# Altium schematic sheet Alimentation.SchDoc
size Tabloid; SheetNumber: 3; SheetTotal: 7
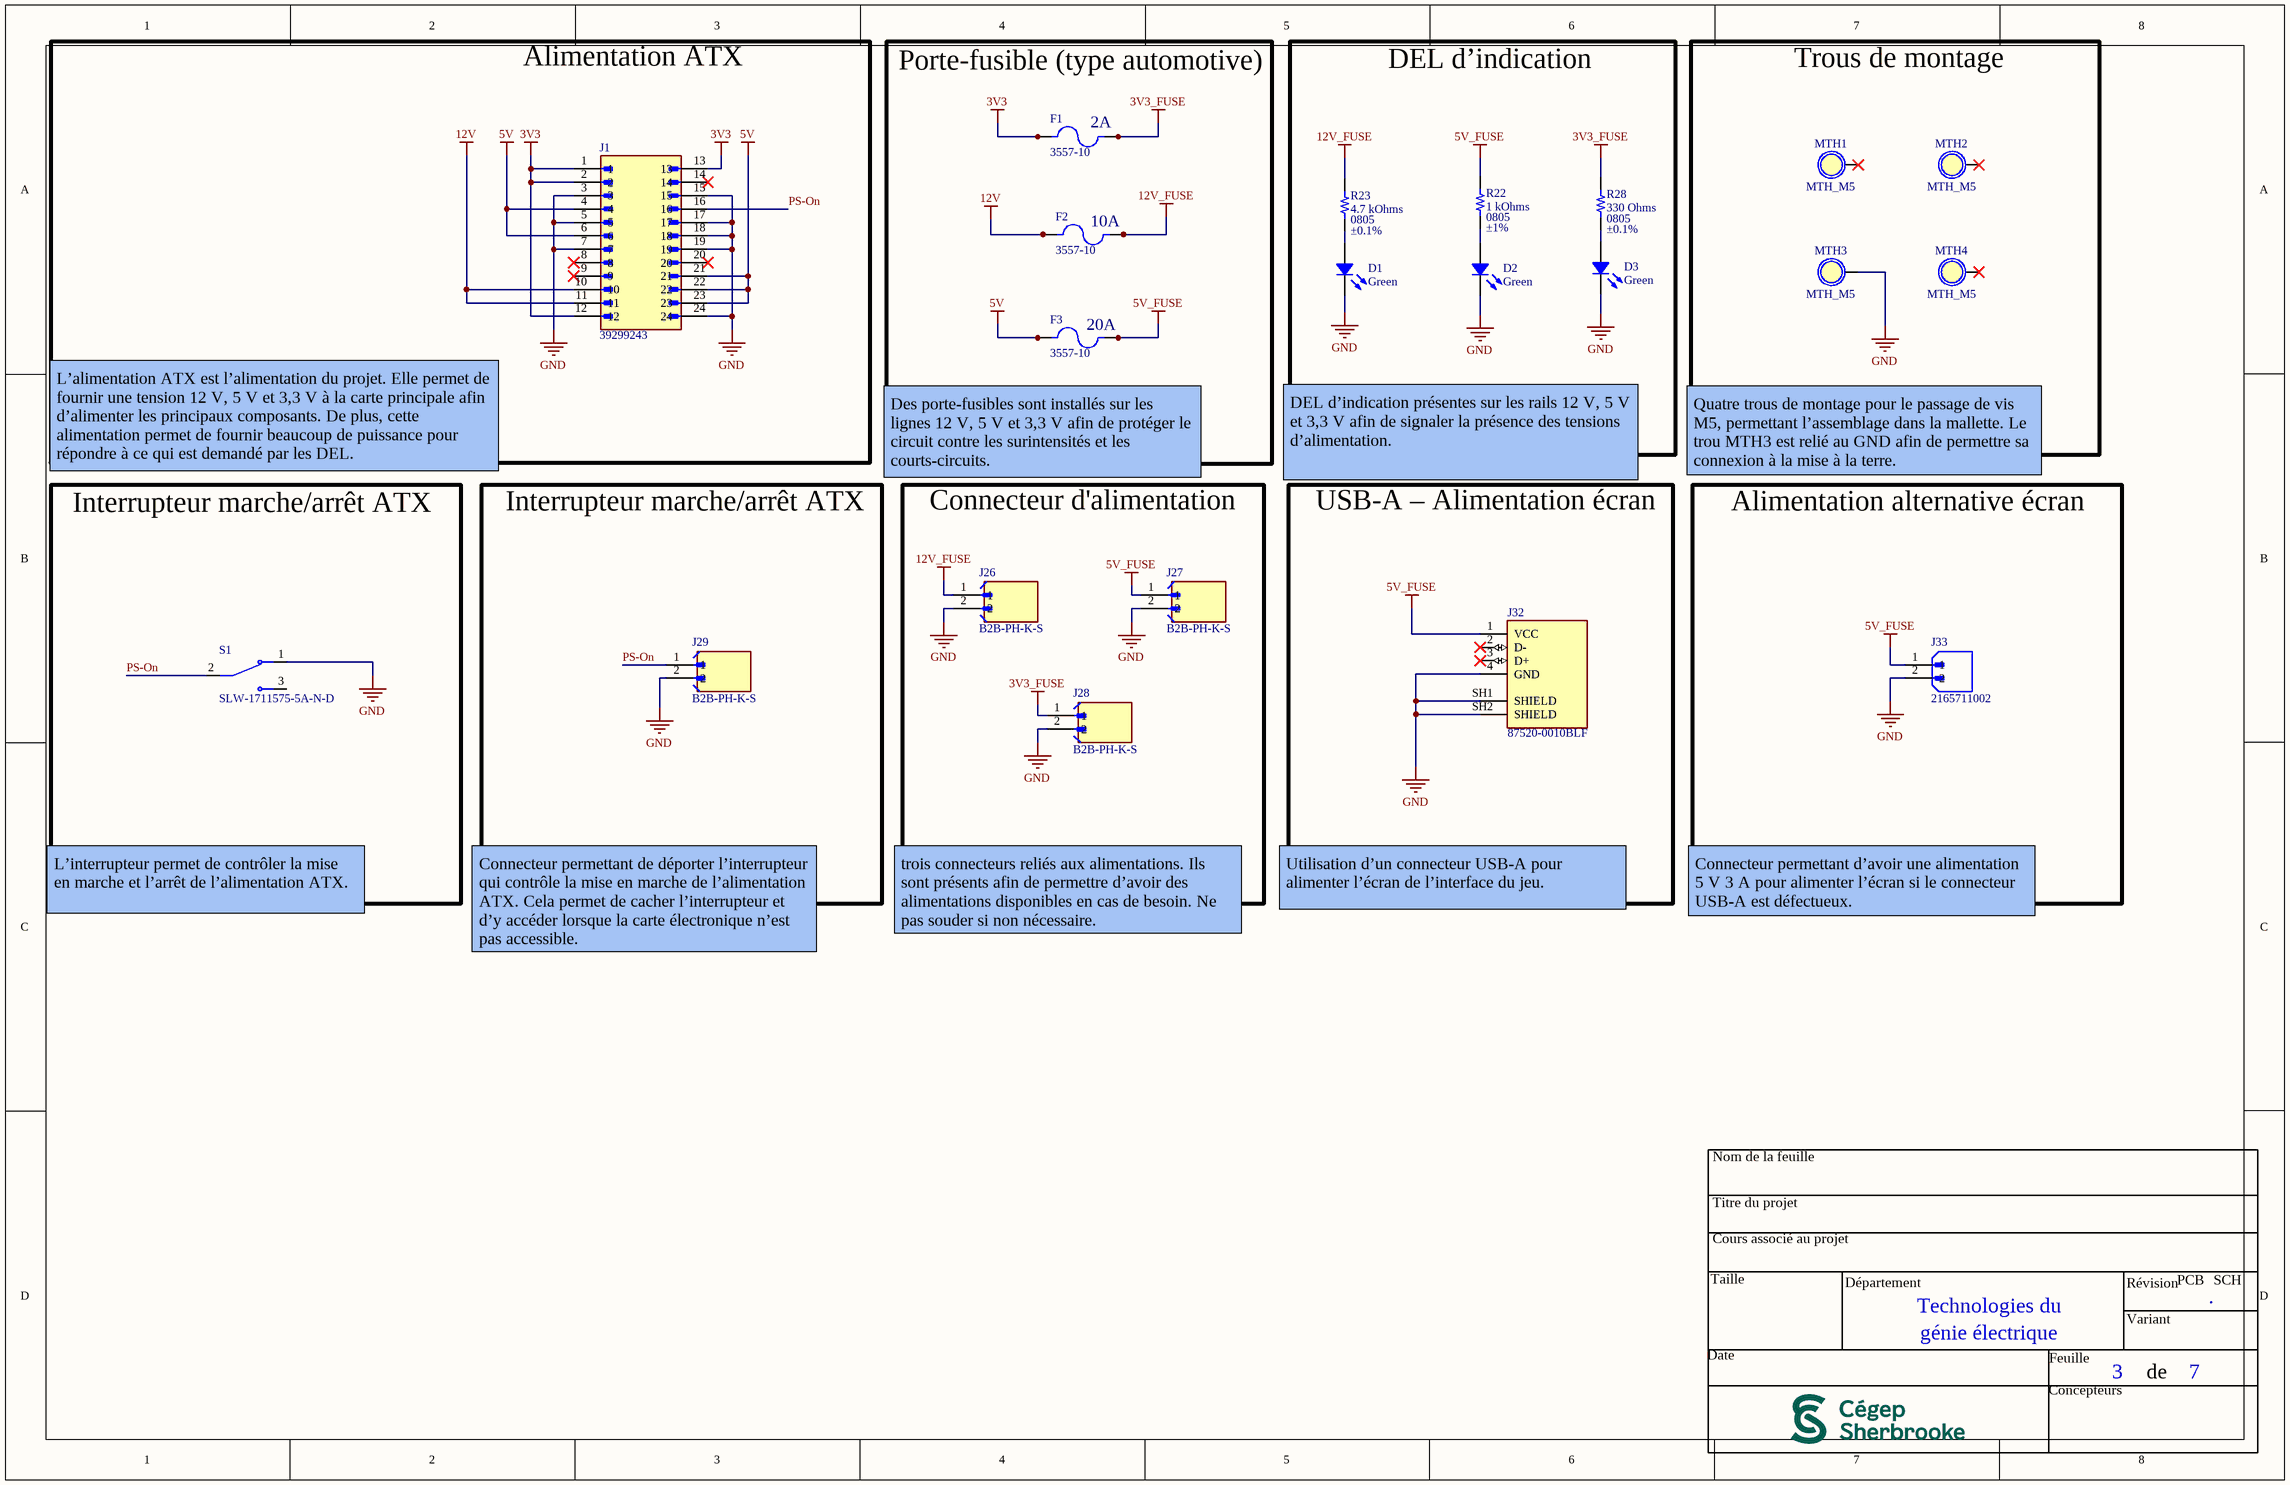
[diagram p0: Alimentation.SchDoc]

## Parts
D1  Green  [LED 0805_2012 GREEN]
D2  Green  [LED 0805_2012 GREEN]
D3  Green  [LED 0805_2012 GREEN]
F1  3557-10  [FUSE_3557-10]
F2  3557-10  [FUSE_3557-10]
F3  3557-10  [FUSE_3557-10]
J1  39299243  [MOLEX_39299243]
J26  B2B-PH-K-S  [JST_B2B-PH-K-S]
J27  B2B-PH-K-S  [JST_B2B-PH-K-S]
J28  B2B-PH-K-S  [JST_B2B-PH-K-S]
J29  B2B-PH-K-S  [JST_B2B-PH-K-S]
J32  87520-0010BLF  [AMPHENOL_87520-0010BLF]
J33  2165711002  [MOLEX_2165711002]
MTH1  MTH_M5  [MTH_M5]  (no BOM)
MTH2  MTH_M5  [MTH_M5]  (no BOM)
MTH3  MTH_M5  [MTH_M5]  (no BOM)
MTH4  MTH_M5  [MTH_M5]  (no BOM)
R22  Supplier Device Package: 0805  Tolerance: ±1%  [RES 0805_2012]  (hidden comment: 1 kOhms)
R23  Supplier Device Package: 0805  Tolerance: ±0.1%  [RES 0805_2012]  (hidden comment: 4.7 kOhms)
R28  Supplier Device Package: 0805  Tolerance: ±0.1%  [RES 0805_2012]  (hidden comment: 330 Ohms)
S1  SLW-1711575-5A-N-D  [SW_SLW-1711575-5A-N-D]

## Blocks framed on the sheet
Alimentation ATX: J1
Porte-fusible (type automotive): F1-F3
DEL d’indication: D1-D3 R22 R23 R28
Trous de montage: MTH1-MTH4
Interrupteur marche/arrêt ATX: S1
Interrupteur marche/arrêt ATX: J29
Connecteur d'alimentation: J26-J28
USB-A – Alimentation écran: J32
Alimentation alternative écran: J33

## Nets
3V3: F1.1_1 F1.1_2 J1.1 J1.2 J1.12 J1.13
3V3_FUSE: F1.2_1 F1.2_2 J28.1 R28.2
5V: F3.1_1 F3.1_2 J1.4 J1.6 J1.21 J1.22 J1.23
5V_FUSE: F3.2_1 F3.2_2 J27.1 J32.1(VCC) J33.1 R22.2
12V: F2.1_1 F2.1_2 J1.10 J1.11
12V_FUSE: F2.2_1 F2.2_2 J26.1 R23.2
GND: D1.2 D2.2 D3.2 J1.3 J1.5 J1.7 J1.15 J1.17 J1.18 J1.19 J1.24 J26.2 J27.2 J28.2 J29.2 J32.4(GND) J32.SH1(SHIELD) J32.SH2(SHIELD) J33.2 MTH3.1 S1.1
PS-On: J1.16 J29.1 S1.2
NetD1_1: D1.1 R23.1
NetD2_1: D2.1 R22.1
NetD3_1: D3.1 R28.1

Not connected (* = marked no-connect by the designer): J1 8* 9* 14* 20*; J32 2(D-)* 3(D+)*; MTH1 1*; MTH2 1*; MTH4 1*; S1 3

## Notes on the sheet
- (near F1) 2A
- (near F2) 10A
- (near F3) 20A
- L’alimentation ATX est l’alimentation du projet. Elle permet de fournir une tension 12 V, 5 V et 3,3 V à la carte principale afin d’alimenter les principaux composants. De plus, cette alimentation permet de fournir beaucoup de puissance pour répondre à ce qui est demandé par les DEL.
- (near F3) Des porte-fusibles sont installés sur les lignes 12 V, 5 V et 3,3 V afin de protéger le circuit contre les surintensités et les courts-circuits.
- DEL d’indication présentes sur les rails 12 V, 5 V et 3,3 V afin de signaler la présence des tensions d’alimentation.
- Quatre trous de montage pour le passage de vis M5, permettant l’assemblage dans la mallette. Le trou MTH3 est relié au GND afin de permettre sa connexion à la mise à la terre.
- Utilisation d’un connecteur USB-A pour alimenter l’écran de l’interface du jeu.
- L’interrupteur permet de contrôler la mise en marche et l’arrêt de l’alimentation ATX.
- Connecteur permettant de déporter l’interrupteur qui contrôle la mise en marche de l’alimentation ATX. Cela permet de cacher l’interrupteur et d’y accéder lorsque la carte électronique n’est pas accessible.
- trois connecteurs reliés aux alimentations. Ils sont présents afin de permettre d’avoir des alimentations disponibles en cas de besoin. Ne pas souder si non nécessaire.
- Connecteur permettant d’avoir une alimentation 5 V 3 A pour alimenter l’écran si le connecteur USB-A est défectueux.
- Nom de la feuille
- Titre du projet
- Cours associé au projet
- Taille
- Département
- Technologies du
- Révision
- PCB
- .
- SCH
- Date
- génie électrique
- Feuille
- Variant
- de
- Concepteurs

## Library data of the parts
D1-D3 = 5975316507F: LED GREEN 0805 SMD; Manufacturer: Dialight; Configuration: Standard; Current - Test: 20mA; Lens Color: 0.93mm; Lens Size: 1.40mm x 1.24mm; Lens Style: Rectangle with Flat Top; Millicandela Rating: 16mcd; Voltage - Forward (Vf) (Typ): 2.2V; Wavelength - Dominant: 560nm; Part Number: 5975316507F; Color: Green; ComponentLink1Description: Datasheet; ComponentLink1URL: http://www.dialightsignalsandcomponents.com/Assets/Drawings/2D_Drawings_DrawingDetailedSpec/NewDrawings/18370A.pdf; ComponentLink2Description: DigiKey Link; ComponentLink2URL: https://www.digikey.com/en/products/detail/dialight/5975316507F/9385444; Device Package: 0805 (2012 Metric); Height (Max): 0.93mm; LastUpdated: 2024-06-03 8:00:30 PM; Lifecycle Status: Active; Minimum Order: 1; Mounting Type: Surface Mount; Package / Case: 0805 (2012 Metric); Packaging: TapeAndReel; PartId: 245; Part Status: Active; Price: 0.12; Series: 597; Size / Dimension: 2.00mm L x 1.25mm W; Supplier 1: DigiKey; Supplier Part Number 1: 350-4389-1-ND; Supplier Device Package: 0805; Value: Green
F1-F3 = 3557-10: MF: Keystone; Package: None; Price: None; Value: *; MP: 3557-10; Availability: Unavailable
J1 = 39299243: Conn Wire to Board HDR 24Power POS 4.2mm Solder ST Top Entry Thru-Hole Tray; Value: *; Price: None; Package: None; Availability: Unavailable; MP: 39299243
J26-J29 = B2B-PH-K-S: Connector Header Through Hole 2 position 0.079 (2.00mm); MF: JST Sales America Inc.; SnapEDA_Link: https://www.snapeda.com/parts/B2B-PH-K-S/JST/view-part/?ref=snap; Package: None; Value: *; MP: B2B-PH-K-S; Check_prices: https://www.snapeda.com/parts/B2B-PH-K-S/JST/view-part/?ref=eda
J32 = 87520-0010BLF: Conn Data USB TypeA Socket 4Cnts RightAngle ThruHole White 1.57mmPCB | Amphenol FCI (Amphenol CS) 87520-0010BLF; MF: AMPHENOL ICC / FCI; SnapEDA_Link: https://www.snapeda.com/parts/87520-0010BLF/Amphenol/view-part/?ref=snap; Package: None; Value: *; MP: 87520-0010BLF; Check_prices: https://www.snapeda.com/parts/87520-0010BLF/Amphenol/view-part/?ref=eda
MTH1-MTH4 = CMP-006-000012-1: MTH - MOUNTING HOLE 5MM PLATED - 5MM; Pin Count: 1; HelpURL: *; Manufacturer #1: *; Source: CEGEP_SHERBROOKE_TGE_LIBRARY.SchLib; Power Max: *; Value: *; Assembly Type: NONE; Polarized: *; Component Type: Standard (No BOM); Note: *; Design Item ID: MTH_M5; Part Number #1: *; Package: 5MM
R22 = RNCP0805FTD1K00: RES 1K OHM 1% 1/4W 0805; Manufacturer: Stackpole Electronics Inc; Power (Watts): 0.25W, 1/4W; Temperature Coefficient: ±100ppm/°C; Part Number: RNCP0805FTD1K00; Value: 1 kOhms; ComponentLink1Description: Datasheet; ComponentLink1URL: https://www.seielect.com/catalog/sei-rncp.pdf; ComponentLink2Description: DigiKey Link; ComponentLink2URL: https://www.digikey.com/en/products/detail/stackpole-electronics-inc/RNCP0805FTD1K00/2240229; Composition: Thin Film; Device Package: 0805 (2012 Metric); Features: Anti-Sulfur; Height - Seated (Max): 0.025" (0.65mm); LastUpdated: 2024-02-08 9:02:37 PM; Lifecycle Status: Active; Minimum Order: 1; Number of Terminations: 2; Operating Temperature: -55°C ~ 155°C; Package / Case: 0805 (2012 Metric); Packaging: TapeAndReel; PartId: 28023; Part Status: Active; Price: 0.01; Resistance: 1 kOhms; Series: RNCP; Size / Dimension: 0.079" L x 0.049" W (2.00mm x 1.25mm); Supplier 1: DigiKey; Supplier Part Number 1: RNCP0805FTD1K00CT-ND
R23 = ERJ-PB6B4701V: RES SMD 4.7K OHM 0.1% 1/4W 0805; Manufacturer: Panasonic Electronic Components; Power (Watts): 0.25W, 1/4W; Temperature Coefficient: ±50ppm/°C; Part Number: ERJ-PB6B4701V; Value: 4.7 kOhms; ComponentLink1Description: Datasheet; ComponentLink1URL: https://industrial.panasonic.com/cdbs/www-data/pdf/RDM0000/AOA0000C328.pdf; ComponentLink2Description: DigiKey Link; ComponentLink2URL: https://www.digikey.com/en/products/detail/panasonic-electronic-components/ERJ-PB6B4701V/6213453; Composition: Thick Film; Device Package: 0805 (2012 Metric); Features: Automotive AEC-Q200, Pulse Withstanding; Height - Seated (Max): 0.028" (0.70mm); LastUpdated: 2024-02-08 9:02:36 PM; Lifecycle Status: Active; Minimum Order: 1; Number of Terminations: 2; Operating Temperature: -55°C ~ 155°C; Package / Case: 0805 (2012 Metric); Packaging: TapeAndReel; PartId: 28385; Part Status: Active; Price: 0.04; Ratings: AEC-Q200; Resistance: 4.7 kOhms; Series: ERJ-PB6; Size / Dimension: 0.079" L x 0.049" W (2.00mm x 1.25mm); Supplier 1: DigiKey; Supplier Part Number 1: P20670CT-ND
R28 = ERJ-PB6B3300V: RES SMD 330 OHM 0.1% 1/4W 0805; Manufacturer: Panasonic Electronic Components; Power (Watts): 0.25W, 1/4W; Temperature Coefficient: ±50ppm/°C; Part Number: ERJ-PB6B3300V; Value: 330 Ohms; ComponentLink1Description: Datasheet; ComponentLink1URL: https://industrial.panasonic.com/cdbs/www-data/pdf/RDM0000/AOA0000C328.pdf; ComponentLink2Description: DigiKey Link; ComponentLink2URL: https://www.digikey.com/en/products/detail/panasonic-electronic-components/ERJ-PB6B3300V/6213320; Composition: Thick Film; Device Package: 0805 (2012 Metric); Features: Automotive AEC-Q200, Pulse Withstanding; Height - Seated (Max): 0.028" (0.70mm); LastUpdated: 2024-02-08 9:02:05 PM; Lifecycle Status: Active; Minimum Order: 1; Number of Terminations: 2; Operating Temperature: -55°C ~ 155°C; Package / Case: 0805 (2012 Metric); Packaging: TapeAndReel; PartId: 35583; Part Status: Active; Price: 0.04; Ratings: AEC-Q200; Resistance: 330 Ohms; Series: ERJ-PB6; Size / Dimension: 0.079" L x 0.049" W (2.00mm x 1.25mm); Supplier 1: DigiKey; Supplier Part Number 1: P20537CT-ND
S1 = SLW-1711575-5A-N-D: Switch Slide ON ON SPDT Raised Slide 0.3A 50VDC 10000Cycles PC Pins Thru-Hole; MF: Same Sky; SnapEDA_Link: https://www.snapeda.com/parts/SLW-1711575-5A-N-D/Same+Sky/view-part/?ref=snap; Package: Package; Value: *; MP: SLW-1711575-5A-N-D; Check_prices: https://www.snapeda.com/parts/SLW-1711575-5A-N-D/Same+Sky/view-part/?ref=eda
J33 = 2165711002: Price: None; Availability: Unavailable; MP: 2165711002; Value: *; Package: None